# EAGLE design zookCopy2004 (EAGLE 7.2.0)
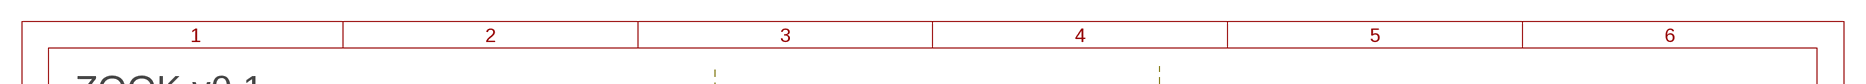
[diagram p0: schematic, sheet 1, part 1 of 2]
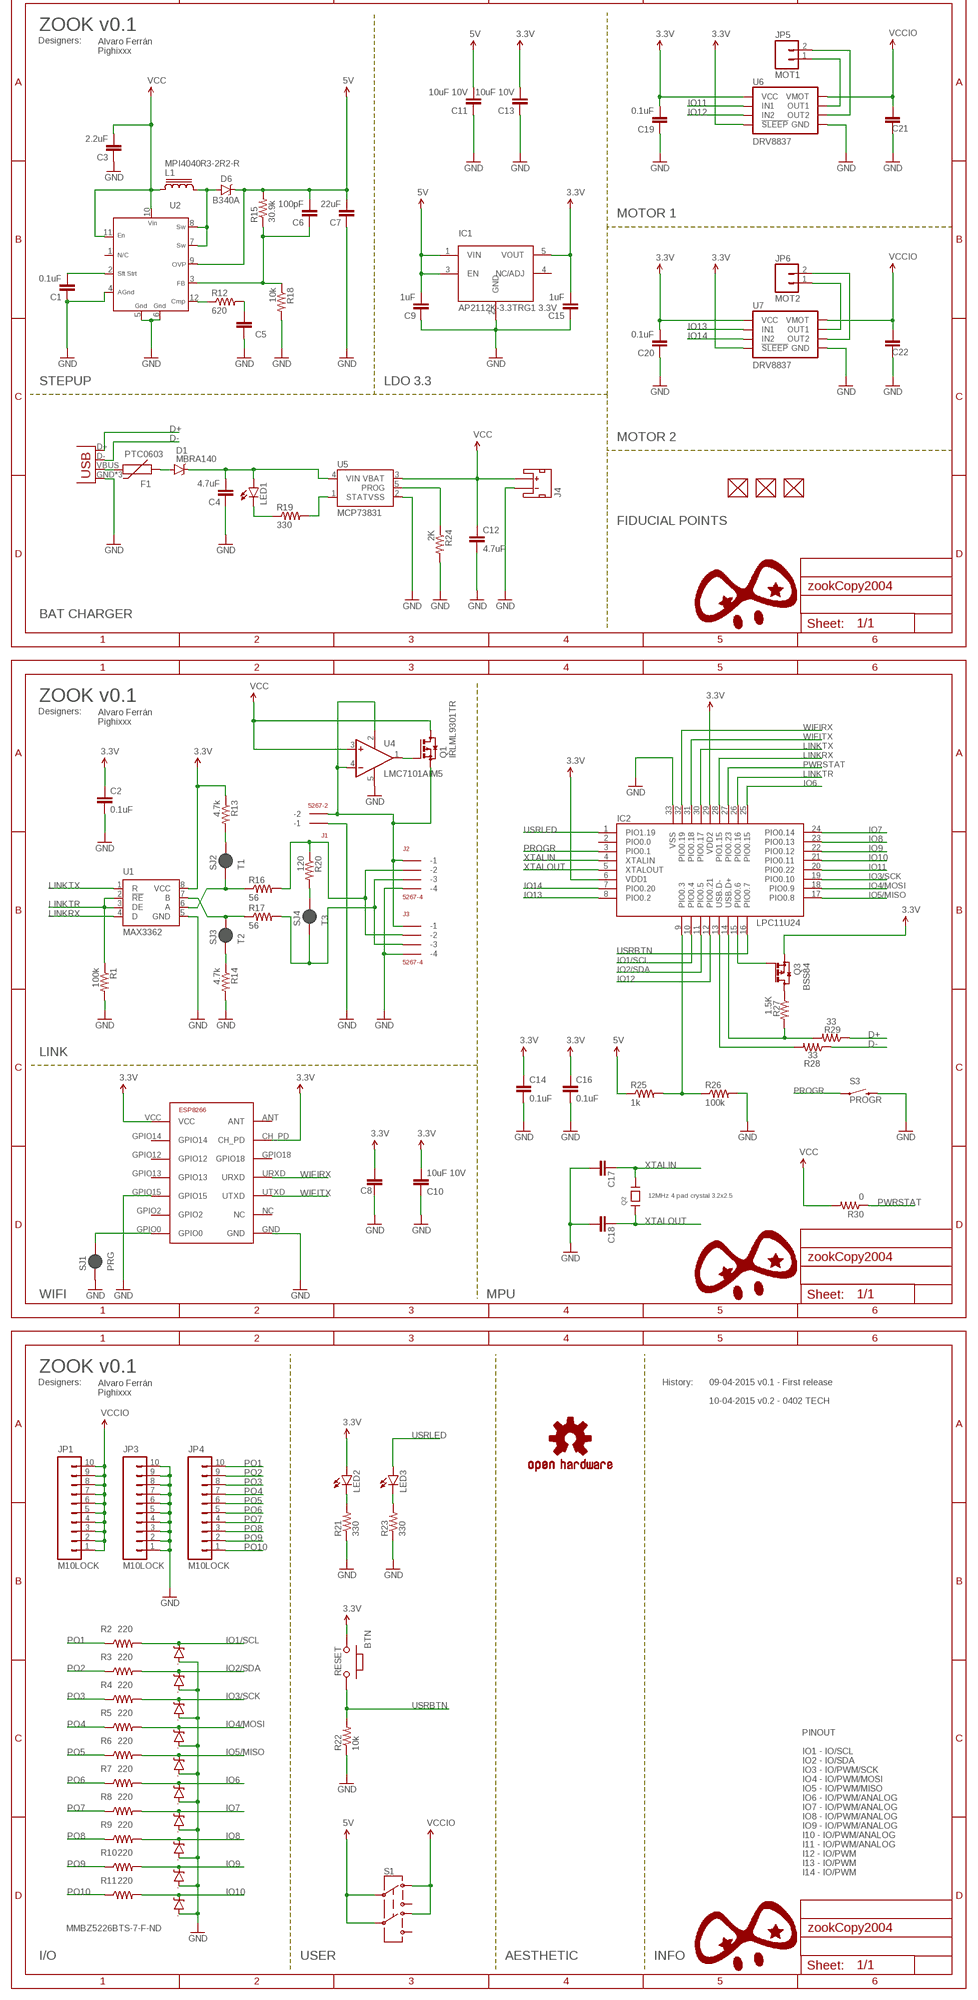
[diagram p1: schematic, sheet 1, part 2 of 2]

## Parts
BTN  RESET  PB157  [157SW]
C1  0.1uF  CAP0402-CAP  [0402-CAP]
C2  0.1uF  CAP0402-CAP  [0402-CAP]
C3  2.2uF  CAP0402-CAP  [0402-CAP]
C4  4.7uF  CAP0402-CAP  [0402-CAP]
C5  10nF  CAP0402-CAP  [0402-CAP]
C6  100pF  CAP0402-CAP  [0402-CAP]
C7  22uF  22UF-6.3V-20%(0805)  [0805]
C8  0.1uF  CAP0402-CAP  [0402-CAP]
C9  1uF  CAP0402-CAP  [0402-CAP]
C10  10uF 10V  CAP0402-CAP  [0402-CAP]
C11  10uF 10V  CAP0402-CAP  [0402-CAP]
C12  4.7uF  CAP0402-CAP  [0402-CAP]
C13  10uF 10V  CAP0402-CAP  [0402-CAP]
C14  0.1uF  CAP0402-CAP  [0402-CAP]
C15  1uF  CAP0402-CAP  [0402-CAP]
C16  0.1uF  CAP0402-CAP  [0402-CAP]
C17  27pF  CAP0402-CAP  [0402-CAP]
C18  27pF  CAP0402-CAP  [0402-CAP]
C19  0.1uF  CAP0402-CAP  [0402-CAP]
C20  0.1uF  CAP0402-CAP  [0402-CAP]
C21  0.1uF  CAP0402-CAP  [0402-CAP]
C22  0.1uF  CAP0402-CAP  [0402-CAP]
D1  MBRA140  [SMA-DIODE]
D2  ZENERARRAY  [SOT363]
D3  ZENERARRAY  [SOT363]
D4  ZENERARRAY  [SOT363]
D5  ZENERARRAY  [SOT363]
D6  B340A  DIODE-SCHOTTKY-B340A  [SMA-DIODE]
F1  PTC0603  [0603]
FUD1  FIDUCIAL  [FIDUCIAL_40MIL]
FUD2  FIDUCIAL  [FIDUCIAL_40MIL]
FUD3  FIDUCIAL  [FIDUCIAL_40MIL]
IC1  AP2112K-3.3TRG1 3.3V  5PIN_REG  [SOT23-5]
IC2  LPC11U24  LPC11U2X_HVQFN33(5X5)  [HVQFN33_5X5MM]
J1  5267-2  [5267-2]
J2  5267-4  [5267-4]
J3  5267-4  [5267-4]
J4  BATT  JST_2MM_MALE  [JST-2-SMD]
JP1  M10LOCK  [1X10_LOCK]
JP2  USB-MICROB  [USB-MICROB]
JP3  M10LOCK  [1X10_LOCK]
JP4  M10LOCK  [1X10_LOCK]
JP5  MOT1  M02POLAR  [MOLEX-1X2]
JP6  MOT2  M02POLAR  [MOLEX-1X2]
L1  MPI4040R3-2R2-R  [MPI4040R3-2R2-R]
LED1  LED0603  [LED-0603]
LED2  LED0603  [LED-0603]
LED3  LED0603  [LED-0603]
LOGO3  OSHW-LOGOS  [OSHW-LOGO-S]
Q1  IRLML9301TR  BSS84  [SOT23]
Q2  12MHz 4 pad crystal 3.2x2.5  CRYSTAL3.2X2.5  [CRYSTAL_3.2X2.5]
Q3  BSS84  [SOT23]
R1  100k  RESISTOR0402-RES  [0402-RES]
R2  220  220KOHM1/10W1%(0603)  [0603-RES]
R3  220  220KOHM1/10W1%(0603)  [0603-RES]
R4  220  220KOHM1/10W1%(0603)  [0603-RES]
R5  220  220KOHM1/10W1%(0603)  [0603-RES]
R6  220  220KOHM1/10W1%(0603)  [0603-RES]
R7  220  220KOHM1/10W1%(0603)  [0603-RES]
R8  220  220KOHM1/10W1%(0603)  [0603-RES]
R9  220  220KOHM1/10W1%(0603)  [0603-RES]
R10  220  220KOHM1/10W1%(0603)  [0603-RES]
R11  220  220KOHM1/10W1%(0603)  [0603-RES]
R12  620  RESISTOR0402-RES  [0402-RES]
R13  4.7k  RESISTOR0402-RES  [0402-RES]
R14  4.7k  RESISTOR0402-RES  [0402-RES]
R15  30.9k  RESISTOR0402-RES  [0402-RES]
R16  56  RESISTOR0402-RES  [0402-RES]
R17  56  RESISTOR0402-RES  [0402-RES]
R18  10k  RESISTOR0402-RES  [0402-RES]
R19  330  RESISTOR0402-RES  [0402-RES]
R20  120  RESISTOR0402-RES  [0402-RES]
R21  330  RESISTOR0402-RES  [0402-RES]
R22  10k  RESISTOR0402-RES  [0402-RES]
R23  330  RESISTOR0402-RES  [0402-RES]
R24  2K  RESISTOR0402-RES  [0402-RES]
R25  1k  RESISTOR0402-RES  [0402-RES]
R26  100k  RESISTOR0402-RES  [0402-RES]
R27  1.5K  RESISTOR0402-RES  [0402-RES]
R28  33  RESISTOR0402-RES  [0402-RES]
R29  33  RESISTOR0402-RES  [0402-RES]
R30  0  RESISTOR0402-RES  [0402-RES]
S1  SWITCH-DPDTOS  [OS]
S3  PROGR  SWITCH-MOMENTARY-2SIDE_EZ  [TACTILE-PTH-SIDEEZ]
SJ1  PRG  JUMPER-PAD-2-NC_BY_PASTE  [PAD-JUMPER-2-NC_BY_PASTE_YES_SILK]
SJ2  T1  JUMPER-PAD-2-NC_BY_PASTE  [PAD-JUMPER-2-NC_BY_PASTE_YES_SILK]
SJ3  T2  JUMPER-PAD-2-NC_BY_PASTE  [PAD-JUMPER-2-NC_BY_PASTE_YES_SILK]
SJ4  T3  JUMPER-PAD-2-NC_BY_PASTE  [PAD-JUMPER-2-NC_BY_PASTE_YES_SILK]
U1  MAX3362  [SOT23-8]
U2  MIC2253  [MLF12_3.0MM_X_3.0MM]
U3  ESP8266  [ESP-03]
U4  LMC7101AIM5  [SOT23-5]
U5  MCP73831  [SOT23-5]
U6  DRV8837  [DSG]
U7  DRV8837  [DSG]

## Nets
3.3V: BTN.1 C2.1 C8.2 C10.2 C13.2 C14.1 C15.2 C16.1 C19.2 C20.2 IC1.5(VOUT) IC2.6(VDD1) IC2.29(VDD2) LED2.A Q3.2(S) R13.1 U1.8(VCC) U3.CH_PD U3.VCC U6.7(!SLEEP) U6.8(VCC) U7.7(!SLEEP) U7.8(VCC)
5V: C6.2 C7.2 C9.2 C11.2 D6.C IC1.1(VIN) IC1.3(EN) R15.2 R25.1 S1.2 S1.5 U2.9(OVP)
D+: JP2.D+ R29.1
D-: JP2.D- R28.1
GND: C1.1 C2.2 C3.1 C4.1 C5.1 C7.1 C8.1 C9.1 C10.1 C11.1 C12.2 C13.1 C14.2 C15.1 C16.2 C17.2 C18.2 C19.1 C20.1 C21.1 C22.1 D2.1(A) D2.2(A) D2.3(A) D3.1(A) D3.2(A) D3.3(A) D4.1(A) D4.2(A) D4.3(A) D5.1(A) IC1.2(GND) IC2.33(VSS) J1.P$1(-1) J2.P$4(-4) J3.P$4(-4) J4.1(-) JP2.GND JP2.MT1(GND) JP2.MT2(GND) JP3.1 JP3.2 JP3.3 JP3.4 JP3.5 JP3.6 JP3.7 JP3.8 JP3.9 JP3.10 R1.2 R14.2 R18.2 R21.1 R22.1 R23.1 R24.2 R26.2 S3.2 SJ1.1 U1.5(GND) U2.4(AGND) U2.5(GND) U2.6(GND) U3.GND U3.GPIO15 U4.5(V-) U5.2(VSS) U6.4(GND) U6.PAD(GND) U7.4(GND) U7.PAD(GND)
IO1/SCL: D2.6(C) IC2.10(PIO0.4) R2.2
IO2/SDA: D2.5(C) IC2.11(PIO0.5) R3.2
IO3/SCK: D2.4(C) IC2.19(PIO0.10) R4.2
IO4/MOSI: D3.6(C) IC2.18(PIO0.9) R5.2
IO5/MISO: D3.5(C) IC2.17(PIO0.8) R6.2
IO6: D3.4(C) IC2.25(PIO0.15) R7.2
IO7: D4.6(C) IC2.24(PIO0.14) R8.2
IO8: D4.5(C) IC2.23(PIO0.13) R9.2
IO9: D4.4(C) IC2.22(PIO0.12) R10.2
IO10: D5.6(C) IC2.21(PIO0.11) R11.2
IO11: IC2.20(PIO0.22) U6.6(IN1)
IO12: IC2.12(PIO0.21) U6.5(IN2)
IO13: IC2.8(PIO0.2) U7.6(IN1)
IO14: IC2.7(PIO0.20) U7.5(IN2)
LINKRX: IC2.28(PIO1.15) U1.4(D)
LINKTR: IC2.26(PIO0.16) R1.1 U1.2(!RE) U1.3(DE)
LINKTX: IC2.30(PIO0.17) U1.1(R)
N$1: J2.P$3(-3) J3.P$3(-3) R17.2 SJ4.1
N$2: LED2.C R21.2
N$3: C5.2 R12.2
N$4: D6.A L1.P$2 U2.7(SW) U2.8(SW)
N$5: C4.2 D1.C LED1.A U5.4(VIN)
N$6: C1.2 U2.2(SS)
N$7: F1.2 JP2.VBUS
N$8: R12.1 U2.12(CMP)
N$9: D1.A F1.1
N$10: JP5.1 U6.2(OUT1)
N$11: JP5.2 U6.3(OUT2)
N$12: R19.2 U5.1(STAT)
N$13: LED1.C R19.1
N$14: JP6.1 U7.2(OUT1)
N$15: JP6.2 U7.3(OUT2)
N$16: R17.1 SJ3.2 U1.7(B)
N$17: R16.1 SJ2.1 U1.6(A)
N$18: R13.2 SJ2.2
N$19: R20.2 SJ4.2
N$20: R14.1 SJ3.1
N$21: J2.P$2(-2) J3.P$2(-2) R16.2 R20.1
N$22: LED3.C R23.2
N$24: C6.1 R15.1 R18.1 U2.3(FB)
N$25: Q1.1(G) U4.1(OUT)
N$26: J1.P$2(-2) J2.P$1(-1) J3.P$1(-1) Q1.2(S) U4.2(V+) U4.4(-IN)
N$27: IC2.14(USB.D+) R27.2 R29.2
N$28: SJ1.2 U3.GPIO0
N$29: IC2.13(USB.D-) R28.2
N$30: Q3.3(D) R27.1
N$31: IC2.15(PIO0.6) Q3.1(G)
P0.3/ISP_COMMAND_USB_HIGH: IC2.9(PIO0.3) R25.2 R26.1
PO1: JP4.10 R2.1
PO2: JP4.9 R3.1
PO3: JP4.8 R4.1
PO4: JP4.7 R5.1
PO5: JP4.6 R6.1
PO6: JP4.5 R7.1
PO7: JP4.4 R8.1
PO8: JP4.3 R9.1
PO9: JP4.2 R10.1
PO10: JP4.1 R11.1
PROG: R24.1 U5.5(PROG)
PROGR: IC2.3(PIO0.1) S3.1
PWRSTAT: IC2.27(PIO0.23) R30.1
USRBTN: BTN.2 IC2.16(PIO0.7) R22.2
USRLED: IC2.1(PIO1.19) LED3.A
VCC: C3.2 C12.1 J4.2(+) L1.P$1 Q1.3(D) R30.2 U2.10(VIN) U2.11(EN) U4.3(+IN) U5.3(VBAT)
VCCIO: C21.2 C22.2 JP1.1 JP1.2 JP1.3 JP1.4 JP1.5 JP1.6 JP1.7 JP1.8 JP1.9 JP1.10 S1.1 S1.4 U6.1(VMOT) U7.1(VMOT)
WIFIRX: IC2.32(PIO0.19) U3.URXD
WIFITX: IC2.31(PIO0.18) U3.UTXD
XTALIN: C17.1 IC2.4(XTALIN) Q2.3
XTALOUT: C18.1 IC2.5(XTALOUT) Q2.1
Unconnected: D5.2(A) D5.3(A) D5.4(C) D5.5(C) FUD1.P$1 FUD2.P$1 FUD3.P$1 IC1.4(NC/ADJ) IC2.2(PIO0.0) J4.NC1(PAD1) J4.NC2(PAD2) S1.3 S1.6 U2.1(NC) U3.ANT U3.GPIO2 U3.GPIO12 U3.GPIO13 U3.GPIO14 U3.GPIO18 U3.NC

## Notes on the sheet
- ZOOK v0.1
- Designers: | Alvaro Ferrán
- Pighixxx
- MOTOR 1
- STEPUP | LDO 3.3
- MOTOR 2
- FIDUCIAL POINTS
- BAT CHARGER
- ZOOK v0.1
- Designers: | Alvaro Ferrán
- Pighixxx
- LINK
- WIFI | MPU
- ZOOK v0.1
- Designers: | Alvaro Ferrán | History: | 09-04-2015 v0.1 - First release
- Pighixxx
- 10-04-2015 v0.2 - 0402 TECH
- PINOUT
- IO1 - IO/SCL
- IO2 - IO/SDA
- IO3 - IO/PWM/SCK
- IO4 - IO/PWM/MOSI
- IO5 - IO/PWM/MISO
- IO6 - IO/PWM/ANALOG
- IO7 - IO/PWM/ANALOG
- IO8 - IO/PWM/ANALOG
- IO9 - IO/PWM/ANALOG
- I10 - IO/PWM/ANALOG
- I11 - IO/PWM/ANALOG
- I12 - IO/PWM
- I13 - IO/PWM
- I14 - IO/PWM
- MMBZ5226BTS-7-F-ND
- I/O | USER | AESTHETIC | INFO

## Library data of the parts
BTN = MySMD:PB157
C1-C6 C8-C22 = SparkFun-Passives:CAP: Capacitor Standard 0603 ceramic capacitor, and 0.1" leaded capacitor.
C7 = SparkFun-Capacitors:22UF-6.3V-20%(0805): CAP-08402 Ceramic; PROD_ID: CAP-08402
D1 = SparkFun-DiscreteSemi:MBRA140: 40V, 1A Schottky rectifier SMA/DO-214AC package DIO-08053; PROD_ID: DIO-08053
D2-D5 = Diode-Array:ZENERARRAY
D6 = SparkFun-DiscreteSemi:DIODE-SCHOTTKY: Schottky diodes in SFE's production catalog BAT20J 1A 23V 0.62Vf RB751 120mA 40V 0.37Vf PMEG4005EJ 0.5A 40V 0.42Vf MBRA140 1A 40V 0.5Vf B340A 3A 40V SMA; PROD_ID: DIO-09886
F1 = SparkFun-PowerIC:PTC: Resettable Fuse PTC Resettable Fuse. Spark Fun Electronics SKU : COM-08357
FUD1-FUD3 = GHI:FIDUCIAL
IC1 = GHI:5PIN_REG
IC2 = GHI-SoMs-Processors:LPC11U2X_HVQFN33(5X5)
J1 = con-molex-spox:5267-2
J2 J3 = con-molex-spox:5267-4
J4 = SparkFun-Connectors:JST_2MM_MALE: Mates to single-cell LiPo batteries. CONN-08352; PROD_ID: CONN-08352
JP1 JP3 JP4 = SparkFun-Connectors:M10: Header 10 Standard 10-pin 0.1" header. Use with straight break away headers (SKU : PRT-00116), right angle break away headers (PRT-00553), swiss pins (PRT-00743), machine pins (PRT-00117), and female headers (PRT-00115).
JP2 = SparkFun-Connectors:USB: USB Connectors USB-B-PTH is fully proven SKU : PRT-00139/CONN-08278 USB-miniB is fully proven SKU : PRT-00587 USB-A-PCB is untested. USB-A-H is throughly reviewed, but untested. Spark Fun Electronics SKU : PRT-00437 USB-B-SMT is throughly reviewed, but untested. Needs silkscreen touching up. USB-A-S has not been used/tested USB-MB-H has not been used/tested USB-MICROB has been used. CONN-09505; PROD_ID: CONN-09505
JP5 JP6 = SparkFun-Connectors:M02: Standard 2-pin 0.1" header. Use with - straight break away headers ( PRT-00116) - right angle break away headers (PRT-00553) - swiss pins (PRT-00743) - machine pins (PRT-00117) - female headers (PRT-00115) Molex polarized connector foot print use with: PRT-08233 with associated crimp pins and housings. 2.54_SCREWTERM for use with PRT-10571. 3.5mm Screw Terminal footprints for PRT-08084 5mm Screw Terminal footprints for use with PRT-08432
L1 = inductor-Eaton Bussmann:MPI4040R3-2R2-R
LED1-LED3 = SparkFun-LED:LED: LEDs Standard schematic elements and footprints for 5mm, 3mm, 1206, and 0603 sized LEDs. 5mm - Spark Fun Electronics SKU : COM-00529 (and others)
LOGO3 = SparkFun-Aesthetics:OSHW-LOGO: Open Source Hardware Logo This logo indicates the piece of hardware it is found on incorporates a OSHW license and/or adheres to the definition of open source hardware found here: http://freedomdefined.org/OSHW
Q1 Q3 = transistor-small-signal:BSS84: P-CHANNEL MOS FET
Q2 = GHI:CRYSTAL3.2X2.5
R1 R12-R30 = SparkFun-Passives:RESISTOR: Resistor Basic schematic elements and footprints for 0603, 1206, and PTH resistors.
R2-R11 = SparkFun-Resistors:220KOHM1/10W1%(0603): RES-08969; PROD_ID: RES-08969; VALUE: 220k
S1 = SparkFun-Electromechanical:SWITCH-DPDT: DPDT Version of the COM-00597
S3 = SparkFun-Electromechanical:SWITCH-MOMENTARY-2: Various NO switches- pushbuttons, reed, etc
SJ1-SJ4 = SparkFun-Passives:JUMPER-PAD-2-NC_BY_PASTE
U1 = MAX3362:MAX3362: MAX3362 3.3V, High-Speed, RS-485/RS-422 Transceiver in SOT23-8 Package
U2 = MIC2253_MLF12:MIC2253: MIC2253 - 3.5A, 1 MHz High Efficiency, Variable Voltage Inuput Boost Regulator with Over Voltage Protection and Soft-Start, Micrel 02-13-2013 - troneeee@gmail.com
U3 = ESP8266:ESP8266: low cost Wifi to Serial Module
U4 = linear:LMC7101AIM5
U5 = SparkFun-PowerIC:MCP73831: Miniature single cell, fully integrated Li-Ion, Li-polymer charge management controller http://ww1.microchip.com/downloads/en/DeviceDoc/21984a.pdf IC-09995; PROD_ID: IC-09995
U6 U7 = packages(ti):DRV8837

## Net classes
0 default: width 0.254 mm, drill 0.254 mm, clearance 0.203 mm

## Board
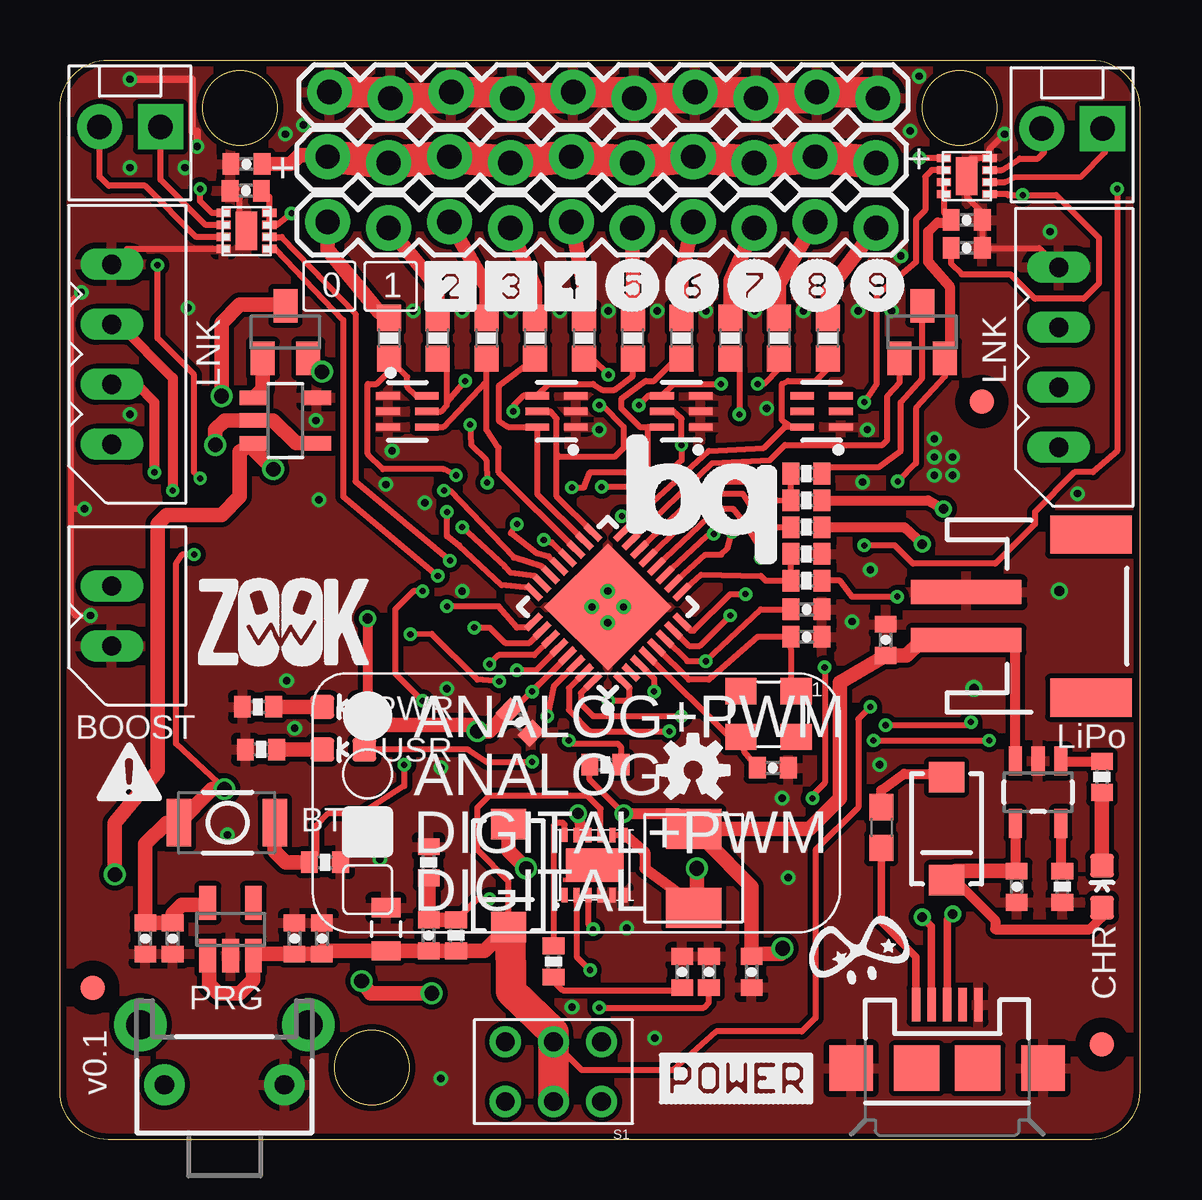
[diagram p2: board, top side]
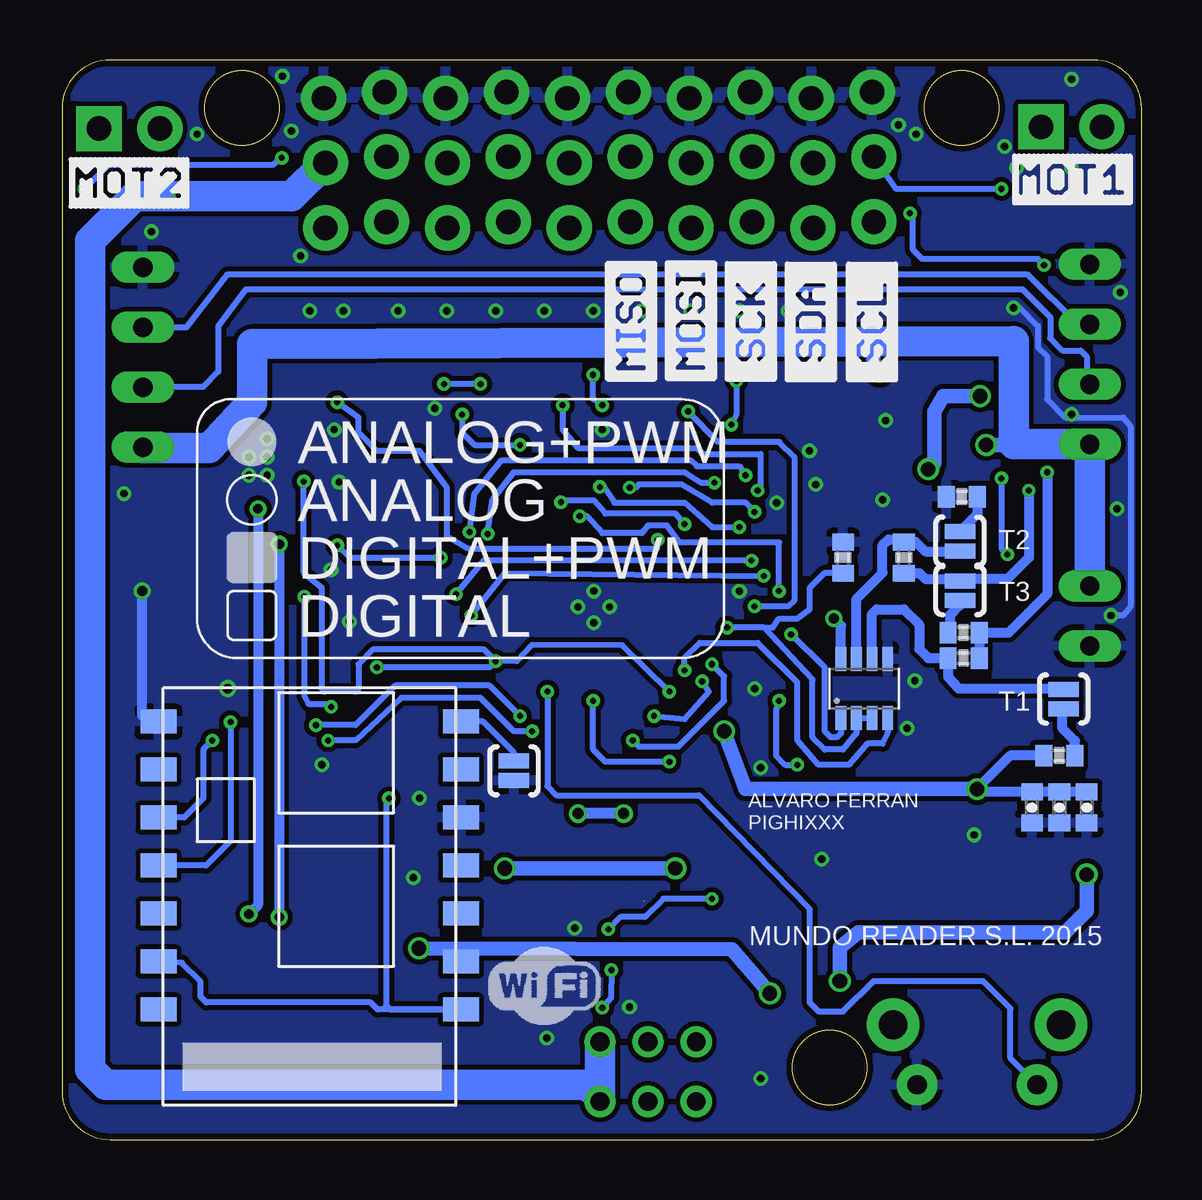
[diagram p3: board, bottom side, seen from below]

Size 45 x 45 mm. Coordinates in mm from the lower left corner, seen from the top.
Outline: 0,2 0,43 arc-90 2,45 43,45 arc-90 45,43 45,2 arc-90 43,0 2,0 arc-90 0,2
Outline: circle at 7.5,43 radius 1.55
Outline: circle at 37.5,43 radius 1.55
Outline: circle at 13,3 radius 1.55
Copper layers (1*16): Top 0.035mm / dielectric 1.5mm / Bottom 0.035mm
Design rules "pighixxx_CAM_DRC_V1.0": minimum track width 6mil, minimum drill 12mil, track to track 6mil, track to pad 6mil, pad to pad 6mil, via to via 6mil, smd to smd 0mil, copper to edge 10mil, drill to drill 10mil, minimum pad ring 10mil, minimum via ring 6mil, stop-mask expansion 2mil, vias tented up to drill 100mil, thermal gap 10mil

### Footprints (pad centres in the part's own frame; a part is rotated, then mirrored left to right if it is on the bottom)
157SW = smd 1.016 x 1.981: 1 0,0; 2 4,0
0402-CAP = smd 0.7 x 0.9: 1 -0.65,0; 2 0.65,0
0805 = smd 0.8 x 1.2: 1 -0.9,0; 2 0.9,0
SMA-DIODE = smd 1.27 x 1.47: A -2.15,0; C 2.15,0
SOT363 = smd 0.3 x 0.99: 1 0.62,0.47; 2 1.27,0.47; 3 1.92,0.47; 4 1.92,2.08; 5 1.27,2.08; 6 0.62,2.08
0603 = smd 1.1 x 1: 1 -0.85,0; 2 0.85,0
FIDUCIAL_40MIL = smd 1.016 x 1.016: P$1 0,0
SOT23-5 = smd 0.7 x 1.4: 1 0.95,1.1; 2 0,1.1; 3 -0.95,1.1; 4 -0.95,-1.1; 5 0.95,-1.1
HVQFN33_5X5MM = smd 0.85 x 0.27: 1 -2.625,1.75; 2 -2.625,1.25; 3 -2.625,0.75; 4 -2.625,0.25; 5 -2.625,-0.25; 6 -2.625,-0.75; 7 -2.625,-1.25; 8 -2.625,-1.75; 17 2.625,-1.75; 18 2.625,-1.25; 19 2.625,-0.75; 20 2.625,-0.25; 21 2.625,0.25; 22 2.625,0.75; 23 2.625,1.25; 24 2.625,1.75 | smd 0.27 x 0.85: 9 -1.75,-2.625; 10 -1.25,-2.625; 11 -0.75,-2.625; 12 -0.25,-2.625; 13 0.25,-2.625; 14 0.75,-2.625; 15 1.25,-2.625; 16 1.75,-2.625; 25 1.75,2.625; 26 1.25,2.625; 27 0.75,2.625; 28 0.25,2.625; 29 -0.25,2.625; 30 -0.75,2.625; 31 -1.25,2.625; 32 -1.75,2.625 | smd 3.75 x 3.75: 33 0,0
5267-2 = drill 0.8 long: P$1 0,0; P$2 2.5,0
5267-4 = drill 0.8 long: P$1 0,0; P$2 2.5,0; P$3 5,0; P$4 7.5,0
JST-2-SMD = smd 1 x 4.6: 1 -1,-3.7; 2 1,-3.7 | smd 1.6 x 3.4: NC1 -3.4,1.5; NC2 3.4,1.5
1X10_LOCK = drill 1.016 pad 1.88: 1 0,0.127; 2 2.54,-0.127; 3 5.08,0.127; 4 7.62,-0.127; 5 10.16,0.127; 6 12.7,-0.127; 7 15.24,0.127; 8 17.78,-0.127; 9 20.32,0.127; 10 22.86,-0.127
USB-MICROB = smd 0.35 x 1.4: D+ 0,2.65; D- -0.65,2.65; GND 1.3,2.65; ID 0.65,2.65; VBUS -1.3,2.65 | smd 1.8 x 1.9: MT1 -4,0; MT2 4,0 | smd 1.9 x 1.9: P$1 -1.27,0; P$2 1.27,0
MOLEX-1X2 = drill 1.016 pad 1.88 square: 1 0,0 | drill 1.016 pad 1.88: 2 2.54,0
MPI4040R3-2R2-R = smd 1.65 x 2.3: P$1 -1.645,0; P$2 1.645,0
LED-0603 = smd 1 x 1: A 0,-0.877; C 0,0.877
SOT23 = smd 1 x 1.4: 1 -0.95,-1.1; 2 0.95,-1.1; 3 0,1.1
CRYSTAL_3.2X2.5 = smd 1.3 x 1.1: 1 -1.1,-0.9; 2 1.2,-0.9; 3 1.2,1; 4 -1.1,1
0402-RES = smd 0.7 x 0.9: 1 -0.65,0; 2 0.65,0
0603-RES = smd 1.1 x 1: 1 -0.85,0; 2 0.85,0
OS = drill 0.787 pad 1.27: 1 -2.007,1.245; 2 0,1.245; 3 2.007,1.245; 4 -2.007,-1.245; 5 0,-1.245; 6 2.007,-1.245
TACTILE-PTH-SIDEEZ = drill 0.8 pad 1.7: 1 -2.5,0; 2 2.5,0 | drill 1.2 pad 2.2: ANCHOR1 -3.5,2.5; ANCHOR2 3.5,2.5
PAD-JUMPER-2-NC_BY_PASTE_YES_SILK = smd 0.635 x 1.27: 1 -0.401,0; 2 0.413,0
SOT23-8 = smd 1 x 0.45: 1 -1.225,0.975; 2 -1.225,0.325; 3 -1.225,-0.325; 4 -1.225,-0.975; 5 1.225,-0.975; 6 1.225,-0.325; 7 1.225,0.325; 8 1.225,0.975
MLF12_3.0MM_X_3.0MM = smd 0.6 x 0.25: 1 -1.244,1.291; 2 -1.242,0.79; 3 -1.242,0.29; 4 -1.242,-0.21; 5 -1.242,-0.71; 6 -1.242,-1.21; 7 1.265,-1.211; 8 1.265,-0.711; 9 1.265,-0.211; 10 1.265,0.289; 11 1.265,0.789; 12 1.266,1.29 | smd 1.4 x 2.4: EXP 0.01,0.038
ESP-03 = smd 1 x 1.5: ANT 4,12.4; CH_PD 6,12.4; GND 16,12.4; GPIO0 16,-0.2; GPIO2 14,-0.2; GPIO12 8,-0.2; GPIO13 10,-0.2; GPIO14 6,-0.2; GPIO15 12,-0.2; GPIO18 8,12.4; NC 14,12.4; URXD 10,12.4; UTXD 12,12.4; VCC 4,-0.2
SOT23-5' = smd 0.6 x 1.2: 1 -0.95,-1.306; 2 0,-1.306; 3 0.95,-1.306; 4 0.95,1.306; 5 -0.95,1.306
SOT23-5'' = smd 0.55 x 1.2: 1 -0.95,-1.3; 2 0,-1.3; 3 0.95,-1.3; 4 0.95,1.3; 5 -0.95,1.3
DSG = smd 0.6 x 0.35: 1 -0.95,0.75; 2 -0.95,0.25; 3 -0.95,-0.25; 4 -0.95,-0.75; 5 0.95,-0.75; 6 0.95,-0.25; 7 0.95,0.25; 8 0.95,0.75 | smd 0.9 x 1.6: PAD 0,0

### Placement (x,y rotation side)
BTN  4.95,13.21 0 top
C1  27.05,6.99 270 top
C2  4.57,13.84 270 bottom
C3  28.83,6.99 90 top
C4  39.88,10.54 90 top
C5  25.93,6.99 270 top
C6  15.37,8.51 270 top
C7  13.59,8.76 270 top
C8  2.29,13.84 90 bottom
C9  9.78,8.38 270 top
C10  3.43,13.84 90 bottom
C11  10.92,8.38 270 top
C12  34.42,20.83 90 top
C13  3.56,8.38 90 top
C14  31.11,22.1 0 top
C15  4.7,8.38 90 top
C16  19.18,17.4 315 top
C17  29.72,15.49 0 top
C18  31.11,20.96 0 top
C19  37.8,38.33 180 top
C20  7.75,39.55 0 top
C21  37.8,37.17 180 top
C22  7.77,40.67 0 top
D1  36.96,12.95 270 top
D2  13.21,31.62 270 top
D3  21.97,29.08 90 top
D4  27.18,29.08 90 top
D5  33.02,29.08 90 top
D6  18.69,11 270 top
F1  34.24,13 270 top
FUD1  1.36,6.33 0 top
FUD2  43.43,3.96 0 top
FUD3  38.43,30.76 0 top
IC1  7.11,8.76 180 top
IC2  22.83,22.2 135 top
J1  2.16,20.57 90 top
J2  2.16,28.98 90 top
J3  41.63,28.85 90 top
J4  41.48,21.82 270 top
JP1  34.02,40.84 180 top
JP2  36.98,2.97 0 top
JP3  34.09,43.54 180 top
JP4  34.02,38.13 180 top
JP5  43.46,42.14 180 top
JP6  4.19,42.21 180 top
L1  26.42,11.3 270 top
LED1  43.43,10.54 0 top
LED2  11.81,18.03 90 top
LED3  11.81,16.26 90 top
LOGO3  26.39,15.39 0 top
Q1  9.4,33.66 0 top
Q2  29.59,17.78 180 top
Q3  35.94,33.66 0 top
R1  12.45,24.26 90 bottom
R2  13.72,33.4 270 top
R3  15.75,33.4 270 top
R4  17.78,33.4 270 top
R5  19.81,33.4 270 top
R6  21.84,33.4 270 top
R7  23.88,33.4 270 top
R8  25.91,33.4 270 top
R9  27.94,33.4 270 top
R10  29.97,33.4 270 top
R11  32,33.4 270 top
R12  20.57,7.42 270 top
R13  3.43,16 0 bottom
R14  7.49,26.8 180 bottom
R15  16.51,8.51 270 top
R16  7.42,20.07 0 bottom
R17  9.91,24.26 270 bottom
R18  15.37,11.56 90 top
R19  43.43,15.11 90 top
R20  7.42,21.13 180 bottom
R21  8.25,18.03 0 top
R22  11.05,11.56 180 top
R23  8.38,16.26 0 top
R24  41.78,10.54 270 top
R25  31.11,23.29 180 top
R26  31.11,24.41 0 top
R27  31.11,27.76 180 top
R28  31.11,25.53 180 top
R29  31.11,26.64 180 top
R30  22.73,15.62 180 top
S1  20.57,2.83 180 top
S3  6.86,2.29 0 top
SJ1  26.16,15.37 90 bottom
SJ2  3.25,18.36 270 bottom
SJ3  7.57,24.94 270 bottom
SJ4  7.57,22.89 270 bottom
U1  11.56,18.8 90 bottom
U2  22.33,11.43 90 top
U3  28.57,1.42 90 bottom
U4  LMC7101AIM5  [SOT23-5']  9.4,29.97 270 top
U5  MCP73831  [SOT23-5'']  40.77,14.48 180 top
U6  37.8,40.16 180 top
U7  7.77,37.87 0 top
U$1  [S_1_P]  12.65,34.49 0 top
U$2  [S_2]  15.3,34.62 0 top
U$3  [S_0_P]  10.1,34.5 0 top
U$4  [S_5_R]  22.97,34.59 0 top
U$5  [S_3]  17.82,34.64 0 top
U$6  [S_4]  20.3,34.63 0 top
U$7  [S_6_R]  25.46,34.57 0 top
U$8  [S_7_R]  28.05,34.58 0 top
U$9  [S_8_R]  30.67,34.58 0 top
U$10  [S_9_R]  33.18,34.58 0 top
U$11  [S_SCL]  12.21,31.67 0 bottom
U$12  [S_SDA]  14.76,31.67 0 bottom
U$13  [S_MOSI]  19.77,31.72 0 bottom
U$14  [S_MISO]  22.26,31.7 0 bottom
U$15  [S_SCK]  17.27,31.69 0 bottom
U$16  [S_MOT1]  5.3,40.99 270 bottom
U$17  [S_MOT2]  44.62,40.85 270 bottom
U$18  [S_LEGEND]  39.24,19.94 0 bottom
U$19  [S_POWER]  25.06,3.53 270 top
U$20  [S_WIFI]  27.2,4.79 0 bottom
U$21  [S_ZOOK_LOGO]  5.71,19.68 0 top
U$22  [BQ_LOGO]  23.62,24 0 top
U$23  [PIGHIXXX_LOGO]  31.24,6.48 0 top
U$24  [S_LEGEND]  10.67,8.51 0 top

### Tracks (layer width: path | path; a pad name or v marks a point on that pad's centre or on a via)
3.3V  (via drill 0.25, 0.41, 0.6)
  Top 0.254: C20.2 8.72,39.3 U7.8 U7.7 9.04,38.12 v9.65,38.61 | v6.86,14.61 4.83,16.51 4.83,24 5.08,24.38 v5.59,24.38 | IC2.6 26.16,19.94 v26.92,19.94 29.21,22.1 C14.1 | C16.1 18.85,17.86 IC2.29 21.15,20.14 v19.68,18.67 | Q3.2 36.89,31.81 35.69,30.48 35.69,28.19 v34.92,27.43 | v31.88,19.68 31.88,14.86 31.37,14.35 v31.37,14.22 | v5.84,27.56 5.59,27.81 5.59,31.88 4.06,33.4 v4.06,36.45 | U6.7 U6.8 36.84,38.63 C19.2
  Top 0.406: Q3.2 37.08,32.75 37.08,35.56 36.19,36.58 36.19,37.85 36.58,38.23 37.04,38.23 C19.2 | v12.83,21.72 12.83,18.3 LED2.A
  Top 0.61: IC1.5 6.08,9.78 5.08,9.78 4.7,9.4 C15.2 C13.2 3.56,12.32 4.45,13.21 BTN.1 6.35,14.61 v6.86,14.61 | C16.1 17.88,17.02 v17.4,17.02 17.14,17.27 13.58,17.27 LED2.A
  Bottom 0.254: v19.68,18.67 21.64,20.6 25.4,20.62 26.04,19.94 v26.92,19.94 | v31.88,19.68 27.18,19.68 v26.92,19.94 | U3.CH_PD 40,7.37 39.23,6.59 39.23,5.96 38.99,5.71 32.13,5.71 31.84,5.42 U3.VCC 31.33,5.42 31.5,5.59 31.5,14.1 v31.37,14.22 | v26.92,19.94 27.43,20.45 32,20.45 32.64,19.81 32.64,18.8 32.77,18.67 34.04,18.67 34.16,18.8 34.16,22.99 34.92,23.62 v34.92,27.43 | v5.84,27.56 5.84,24.64 v5.59,24.38 | v4.06,36.45 4.32,36.7 9.14,36.7 9.52,37.08 9.52,38.48 v9.65,38.61
  Bottom 0.406: R13.1 5.46,16 v6.86,14.61 6.75,14.49 C2.1 C10.2 C8.2 | U1.8 12.53,21.42 v12.83,21.72
  Bottom 0.61: v6.86,14.61 16.51,14.61 v17.4,17.02
5V  (via drill 0.25)
  Top 0.254: D6.C 18.69,10.77 17.4,12.07 17.4,13.84 17.91,14.35 21.97,14.35 22.54,13.78 U2.9 | v33.78,18.03 33.27,17.53 33.27,13.84 31.5,12.07 31.5,5.07 30.93,4.5 27.35,4.5 25.53,2.88 21.76,2.88 S1.5 | v34.9,22.63 33.02,22.63 32.51,23.29 R25.1
  Top 0.61: D6.C 17.7,7.86 R15.2 C6.2 C7.2 10.92,7.86 C11.2 C9.2 8.13,7.73 IC1.3 8.06,6.67 7.49,6.1 6.6,6.1 6.22,6.48 6.22,7.6 IC1.1
  Top 1.27: S1.2 S1.5 20.57,4.46 18.8,6.19 18.79,8.77 D6.C
  Bottom 0.254: v34.9,22.63 34.9,18.49 34.72,18.16 33.91,18.16 v33.78,18.03
D+  (via drill 0.41)
  Top 0.305: JP2.D+ 36.98,9.17 v37.21,9.4
  Top 0.406: R29.1 36.19,26.64 v36.83,26.29
  Bottom 0.406: v36.83,26.29 36.83,9.78 v37.21,9.4
D-  (via drill 0.41)
  Top 0.305: v35.94,9.27 36.33,8.88 JP2.D-
  Top 0.406: R28.1 35.18,25.53 v35.94,24.82
  Bottom 0.406: v35.94,24.82 v35.94,9.27
GND  (via drill 0.3, 0.41)
  Top 0.254: 7.37,39.62 C20.1 7.49,39.23 7.49,37.9 7.75,37.9 U7.PAD | U7.4 2.8,37.12 J2.P$4 | 26.72,29.72 D4.1 | U6.PAD 37.82,39.28 37.82,39.27 38.44,38.64 C19.1 C21.1 40.82,37.17 J3.P$4 | 37.72,40.61 U6.PAD | v1.27,21.84 0.63,21.84 0.46,22.1 0.46,26.29 | v0.89,35.31 0.52,34.99 0.46,34.92 0.46,26.29 | v39.37,41.91 38.75,41.28 U6.4 37.99,40.91 37.85,40.77 37.85,40.21 U6.PAD | v1.02,26.29 0.46,26.29
  Top 0.305: v2.92,44.2 5.51,44.2 5.51,42.04 5.71,42.04 v5.71,41.4
  Top 0.406: v22.17,22.2 22.15,22.23 22.1,22.23 22.12,22.2
  Top 0.61: 22.12,22.2 IC2.33
  Top 1.27: JP3.10 13.52,43.66 JP3.9 16.06,43.41 JP3.8 18.6,43.66 JP3.7 21.14,43.41 JP3.6 23.68,43.66 JP3.5 26.22,43.41 JP3.4 28.76,43.66 JP3.3 31.3,43.41 JP3.2 33.84,43.66 JP3.1
  Bottom 0.254: 5.46,34.67 5.08,34.67 4.32,33.91 4.32,33.02 3.94,32.64 3.94,30.86 3.18,30.1 0.76,30.1 0.46,29.72 0.46,22.23 0.76,21.84 v1.27,21.84
  Bottom 0.406: U3.GND 41.38,17.42 41.4,17.4 41.66,17.65 v41.66,22.86
  other vias: 22.83,22.86 23.5,22.2 22.83,21.54 23.62,8.81 22.48,29.59 29.46,30.48 13.34,11.68 6.98,12.7 13.84,28.7 33.66,29.59 33.78,23.75 30.1,14.22 33.02,21.59 9.45,19.13 10.67,29.97 10.79,26.67 10.14,42.29 9.4,41.91 5.21,40.51 36.45,29.21 36.45,28.45 36.45,27.69 37.21,28.45 37.21,27.69 15.88,2.54 38.1,18.8 5.33,34.67 30.35,10.92 2.92,30.23 15.21,26.54 13.59,27.31 34.16,15.62 22.86,34.54 24.89,34.54 26.92,34.54 28.96,34.54 30.99,34.54 20.83,34.54 18.8,34.54 16.76,34.54 14.73,34.54 33.27,34.54 42.42,26.92 2.92,40.51 34.67,34.54 33.45,27.41 15.88,15.49 16.13,18.8 16.76,22.86 9.78,17.14 24.79,4.23 21.35,5.52 35.81,44.32 35.43,42.04 35.43,42.04 41.28,37.85 35.05,36.83
  pour Top: -0.38,45.72 48.13,45.85 48.13,-1.78 -0.38,-1.9
  pour Bottom: -1.52,46.86 46.99,46.99 46.99,-0.63 -1.52,-0.76
IO1/SCL  (via drill 0.25)
  Top 0.254: 14.87,31 D2.6 14.84,31 14.48,31.37 14.48,31.79 R2.2 13.72,32 13.21,31.5 12.83,31.5 12.83,28.57 13.46,27.94 16,27.94 v16.51,27.69 | IC2.10 26.91,24.38 27.56,24.38 27.81,24.64 v28.02,25.32
  Bottom 0.254: v16.51,27.69 16.76,28.07 18.54,28.07 18.8,28.32 26.67,28.32 27.81,26.92 v28.02,25.32
IO2/SDA  (via drill 0.25)
  Top 0.254: D2.5 15.88,30.35 16.13,30.61 16.13,30.73 | 16.13,30.73 16.13,32.17 R3.2 | 16.13,30.73 v16.89,31.62 | IC2.11 26.97,25.15 v27.25,25.25 | v17.09,29.79 17.14,28.96 17.78,28.32 v17.81,27.38
  Bottom 0.254: v16.89,31.62 16.89,30.23 v17.09,29.79 | v27.25,25.25 27.05,26.67 26.16,27.81 19.05,27.81 18.36,27.38 v17.81,27.38
IO3/SCK
  Top 0.254: IC2.19 18.29,27.81 18.29,28.83 17.78,29.59 17.78,31.62 | 17.78,31.62 R4.2 | D2.4 15.99,29.7 17.78,31.62
IO4/MOSI
  Top 0.254: R5.2 18.29,31.41 18.29,29.97 18.68,29.7 D3.6 19.89,26.91 IC2.18
IO5/MISO  (via drill 0.25)
  Top 0.254: IC2.17 20.7,26.81 20.7,28.57 | R6.2 22.19,32.55 v22.86,31.88 | v22.48,30.61 22.61,30.61 23.5,29.72 23.5,28.83 23.11,28.45 20.83,28.45 20.7,28.57 | 20.7,28.57 20.7,30.05 20.45,30.35 D3.5
  Bottom 0.254: v22.48,30.61 22.86,30.86 v22.86,31.88
IO6  (via drill 0.25)
  Top 0.254: R7.2 23.88,31.83 23.11,31.24 22.61,31.24 22.22,31.5 20.38,31.5 D3.4 19.32,31 18.92,30.61 v18.9,30.35 | IC2.25 19.5,21.34 19.05,21.34 18.29,22.23 v16.13,22.23
  Bottom 0.254: v16.13,22.23 14.73,22.23 14.48,22.48 14.48,28.45 15.11,29.08 17.65,29.08 v18.9,30.35
IO7  (via drill 0.25)
  Top 0.254: 24.51,29.7 24.17,29.7 23.39,30.48 23.39,30.86 24.41,31.62 24.76,31.62 25.69,32.55 R8.2 | 24.51,29.7 D4.6 | IC2.24 19.57,22.99 18.42,23.11 16.64,24.77 16.13,25.15 v16.13,26.16 | v21.34,27.18 21.84,27.18 22.1,27.81 24.51,27.81 24.51,29.7
  Bottom 0.254: v16.13,26.16 16.51,26.54 17.91,26.54 19.18,27.31 20.96,27.31 21.08,27.18 v21.34,27.18
IO8  (via drill 0.25)
  Top 0.254: v22.58,27.2 24.64,27.2 25.91,28.32 v25.91,28.96 25.91,30.05 25.58,30.35 D4.5 | v16.76,25.53 18.54,23.88 18.8,23.62 19.77,23.5 IC2.23 | R9.2 28.32,32.17 v28.32,30.23
  Bottom 0.254: v25.91,28.96 27.81,28.96 28.32,29.46 v28.32,30.23 | v22.58,27.2 22.4,27.2 21.97,26.54 19.05,26.54 17.91,25.53 v16.76,25.53
IO9  (via drill 0.25)
  Top 0.254: R10.2 29.97,32.13 29.34,31.5 v29.08,31.5 | v27.56,31.5 25.59,31.5 D4.4 24.53,31 v24.13,30.61 | IC2.22 20.1,23.88 18.92,24.26 16.26,27.05 v16,27.05
  Bottom 0.254: v27.56,31.5 v29.08,31.5 | v24.13,30.61 24.13,29.59 23.5,28.83 18.54,28.83 18.29,28.57 15.88,28.57 15.88,27.18 v16,27.05
IO10  (via drill 0.25)
  Top 0.254: IC2.21 20.37,24.31 19.89,24.43 18.8,25.27 v19.05,25.65 | v24.21,26.57 24.71,26.57 27.05,28.7 29.34,28.83 30.21,29.7 D5.6 30.5,29.7 30.1,29.97 30.1,31.5 30.35,31.62 31.5,31.62 32,32.13 R11.2
  Bottom 0.254: v19.05,25.65 19.43,26.09 22.35,26.09 22.83,26.64 24.08,26.64 v24.21,26.57
IO11  (via drill 0.25)
  Top 0.254: v33.53,30.73 34.04,31.5 34.04,35.18 35.69,36.58 35.69,38.35 36.07,38.73 36.07,40.13 36.34,40.41 U6.6 | v20.17,24.99 20.5,24.89 IC2.20
  Bottom 0.254: v20.17,24.99 20.19,24.64 28.07,24.64 28.96,25.15 28.96,27.18 30.1,28.7 31.88,28.7 32.64,29.46 32.64,30.1 v33.53,30.73
IO12  (via drill 0.25)
  Top 0.254: v33.53,24.77 34.8,24.77 35.56,24 38.99,24 40.64,25.65 40.64,26.16 42.29,27.81 43.05,27.81 44.07,28.7 v44.07,39.62 | v29.21,24.26 29.21,24.61 28.57,25.65 28.07,26.29 27.4,26.29 IC2.12 | U6.5 35.85,40.91 v35.84,40.92
  Bottom 0.254: v44.07,39.62 43.05,40.64 36.19,40.64 v35.84,40.92 | v33.53,24.77 33.02,24.26 v29.21,24.26
IO13  (via drill 0.25)
  Top 0.254: U7.6 9.24,37.62 12.32,34.42 12.32,27.43 v16.26,24.13 | IC2.8 26.3,21.21 26.42,21.21 27.94,22.73 v28.57,22.73
  Bottom 0.254: v16.26,24.13 27.43,24.13 v28.57,22.73
IO14  (via drill 0.25)
  Top 0.254: U7.5 8.98,37.12 11.81,34.16 11.81,26.8 v15.75,23.5 | IC2.7 26.23,20.57 26.67,20.57 v27.94,21.84
  Bottom 0.254: v27.94,21.84 26.54,23.62 v15.75,23.5
LINKRX  (via drill 0.25)
  Top 0.254: IC2.28 19.84,19.56 v19.05,19.56
  Bottom 0.254: U1.4 10.58,16.98 10.79,16.51 11.43,16.51 12.19,15.62 13.46,15.62 14.35,16.64 14.35,19.05 16,20.7 18.42,20.7 19.05,20.07 v19.05,19.56
LINKTR  (via drill 0.25)
  Top 0.254: v17.27,21.34 17.91,21.34 18.54,20.7 19.57,20.7 IC2.26
  Bottom 0.254: U1.3 U1.2 11.88,16.95 12.45,16.26 13.21,16.26 13.72,16.76 13.72,19.18 15.75,21.34 | 15.75,21.34 v17.27,21.34 | 15.75,21.34 15.37,21.34 15.11,21.72 14.35,21.72 13.84,22.1 13.84,22.99 13.22,23.61 R1.1
LINKTX  (via drill 0.25)
  Top 0.254: IC2.30 20.57,18.88 v20.32,17.65 | v18.31,19.1 17.4,19.18 15.49,21.08 v14.61,21.06
  Bottom 0.254: U1.1 12.53,16.93 12.7,16.76 12.95,16.76 13.21,17.02 13.21,19.68 v14.61,21.06 | v20.32,17.65 19.05,17.53 18.03,18.67 v18.31,19.1
N$1  (via drill 0.25)
  Top 0.406: J2.P$3 2.47,33.98 4.7,31.75 v4.7,27.05
  Bottom 0.254: J3.P$3 39.81,33.85 38.1,36.07 4.75,36.07 2.67,33.98 2.67,33.78 2.47,33.98 J2.P$3
  Bottom 0.406: v4.7,27.05 4.7,24.26 5.59,23.37 7.49,23.37 SJ4.1 7.65,23.37 9.02,23.37 9.26,23.61 R17.2
N$2
  Top 0.61: R21.2 LED2.C
N$3
  Top 0.254: 20.59,6.59 R12.2 20.57,6.6 20.96,6.22 25.82,6.22 C5.2
N$4  (via drill 0.6, 0.61)
  Top 0.254: U2.8 U2.7 | 26.42,9.82 L1.P$2 26.54,9.79
  Top 0.457: U2.7 24.38,11.98 24.38,11.3 26.42,9.82
  Top 0.61: D6.A 18.69,12.04 v19.43,11.3 | v26.54,11.3 26.54,9.79
  Bottom 0.61: v19.43,11.3 v26.54,11.3
N$5
  Top 0.406: U5.4 39.82,11.25 C4.2 | LED1.A 43.43,9.27 42.93,8.76 38.99,8.76 38.99,9.14 37.33,10.8 D1.C
  Top 0.61: C4.2 37.34,11.19 D1.C
N$6  (via drill 0.25)
  Top 0.254: U2.2 21.53,7.62 v22.1,7.06 | v22.48,5.49 26.84,5.5 27.05,5.71 C1.2
  Bottom 0.254: v22.1,7.06 22.11,5.91 v22.48,5.49
N$7
  Top 0.305: F1.2 34.24,9.07 35.68,7.62 JP2.VBUS
N$8
  Top 0.254: U2.12 21.04,13.13 20.96,13.21 20.7,13.21 20.57,13.08 R12.1
N$9
  Top 0.406: F1.1 34.24,14.55 35.18,15.24 36.82,15.24 D1.A
N$10
  Top 0.254: U6.2 39.4,39.91 39.78,40.11 42.55,40.13 43.56,41.15 43.56,42.09 JP5.1
N$11
  Top 0.254: U6.3 39.26,40.41 40,40.89 40.77,40.89 41.02,41.15 41.02,42.09 JP5.2
N$12
  Top 0.406: U5.1 41.73,15.76 R19.2
N$13
  Top 0.61: R19.1 LED1.C
N$14
  Top 0.254: U7.2 6.07,38.12 4.19,40 JP6.1
N$15
  Top 0.254: U7.3 5.69,37.62 3.56,39.75 2.03,39.75 1.65,40.13 JP6.2
N$16
  Bottom 0.406: U1.7 11.88,22.54 10.79,23.62 10.79,24.77 10.54,25.02 10.02,25.02 R17.1 9.41,24.91 9.02,24.51 7.59,24.51 SJ3.2
N$17
  Bottom 0.406: U1.6 11.23,21.91 11.05,22.1 9.91,22.1 9.27,21.46 9.27,20.45 8.89,20.07 R16.1 8.07,19.29 7.62,18.8 3.28,18.8 SJ2.1
N$18
  Bottom 0.406: R13.2 2.78,16.62 3.3,17.14 3.3,17.9 SJ2.2
N$19
  Bottom 0.406: SJ4.2 7.57,22.28 8,21.84 8,21.33 R20.2
N$20
  Bottom 0.406: 7.48,25.43 SJ3.1 6.84,26.07 R14.1
N$21  (via drill 0.25)
  Top 0.406: J2.P$2 3.19,31.48 3.94,30.73 v3.94,27.81
  Bottom 0.254: J3.P$2 41.62,31.37 39.12,31.37 38.48,32 38.48,33.91 37.34,35.43 4.95,35.43 3.81,34.29 3.81,33.4 3.3,32.89 2.54,32.89 2.29,32.64 2.29,31.61 J2.P$2 2.17,31.5
  Bottom 0.406: v3.94,27.81 3.94,22.73 5.54,21.13 R20.1 R16.2
N$22
  Top 0.61: R23.2 LED3.C
N$24  (via drill 0.25)
  Top 0.254: R15.1 16.52,9.16 17.4,10.03 v17.91,10.03 | v22.22,8.76 22.04,8.95 U2.3
  Top 0.61: R18.1 C6.1 R15.1
  Bottom 0.254: v17.91,10.03 19.94,10.03 20.7,9.27 21.72,9.27 v22.22,8.76
N$25
  Top 0.61: Q1.1 8.45,31.28 U4.1
N$26  (via drill 0.61)
  Top 0.61: v6.48,28.96 6.48,29.59 6.86,29.97 U4.2 8.89,29.97 9.84,29.02 U4.4 | Q1.2 10.37,32.56 v10.92,32
  Bottom 0.61: v6.48,28.96 5.84,28.96 5.33,29.46 | v10.92,32 11.18,32.26 11.18,33.25
  Bottom 1.27: J3.P$1 41.63,28.83 38.86,28.83 37.08,30.73 37.08,33.15 11.18,33.25 5.33,33.27 5.33,29.46 5.33,28.98 J2.P$1 J1.P$2
N$27
  Top 0.254: IC2.14 27.13,27.43 28.7,27.43 29.34,26.67 R29.2 R27.2
N$28
  Bottom 0.254: SJ1.2 26.16,16.13 27.46,17.42 U3.GPIO0
N$29
  Top 0.254: IC2.13 27.33,26.92 28.45,26.92 29.34,25.53 R28.2
N$30
  Top 0.254: Q3.3 35.94,31.75 35.05,30.73 35.05,28.7 34.11,28.02 31.76,28.02 R27.1
N$31
  Top 0.254: IC2.15 27.19,28.19 29.59,28.32 30.23,28.96 34.29,28.96 34.48,29.15 34.49,31 35,31.57 Q3.1
P0.3/ISP_COMMAND_USB_HIGH
  Top 0.254: IC2.9 26.73,23.55 29.21,23.5 29.41,23.29 R25.2 R26.1
PO1
  Top 0.61: R2.1 13.3,34.48 11.16,37.08 JP4.10
PO2
  Top 0.61: R3.1 15.75,35.52 JP4.9
PO3
  Top 0.61: R4.1 17.78,35.52 JP4.8
PO4
  Top 0.61: R5.1 19.81,35.52 JP4.7
PO5
  Top 0.61: R6.1 21.84,35.52 JP4.6
PO6
  Top 0.61: R7.1 JP4.5
PO7
  Top 0.61: R8.1 25.91,36.03 JP4.4
PO8
  Top 0.61: R9.1 27.94,35.78 JP4.3
PO9
  Top 0.61: R10.1 29.97,35.65 JP4.2
PO10
  Top 0.61: R11.1 32,35.39 JP4.1
PROG
  Top 0.406: U5.5 41.72,11.26 R24.1
PROGR  (via drill 0.25)
  Top 0.254: IC2.3 24.76,19.21 v24.76,18.67
  Bottom 0.254: v24.76,18.67 24.76,14.73 24.38,14.35 18.46,14.35 13.84,9.61 13.84,5.71 13.46,5.33 12.45,5.33 11.18,6.6 6.6,6.6 5.46,5.46 5.46,3.39 S3.1
PWRSTAT  (via drill 0.25)
  Top 0.254: v21.21,16.64 21.34,16.51 23.24,16.51 23.38,16.37 R30.1 | IC2.27 19.77,20.19 18.29,20.19 v17.91,19.81
  Bottom 0.254: v21.21,16.64 20.96,16.38 19.3,16.38 17.4,18.29 17.4,19.3 v17.91,19.81
USRBTN  (via drill 0.25)
  Top 0.254: R22.2 10.67,11.83 10.67,13.08 11.18,13.59 12.57,13.59 14.35,14.73 v14.35,15.62 | v15.11,22.86 14.73,22.86 13.97,22.1 13.97,19.43 v15.11,18.29 | IC2.16 23.88,25.72 23.88,25.91 23.8,25.98 v23.42,25.98
  Top 0.61: 10.36,11.6 R22.2 9.4,11.56 8.95,12 BTN.2
  Bottom 0.254: v15.11,22.86 15.11,24.89 19.25,24.89 19.79,25.6 20.57,25.6 20.83,25.27 22.48,25.27 23.11,25.98 v23.42,25.98 | v15.11,18.29 15.24,17.91 15.24,16 14.86,15.62 v14.35,15.62
USRLED  (via drill 0.25)
  Top 0.254: IC2.1 23.75,18.81 23.75,18.41 23.62,18.29 v22.86,18.29 | LED3.A 17.02,16.26 17.78,15.75 v19.68,15.75
  Bottom 0.254: v19.68,15.75 22.35,15.75 22.86,16.26 v22.86,18.29
VCC  (via drill 0.46, 0.61)
  Top 0.254: U2.11 U2.10 21.78,12.76 | 25.78,13.59 L1.P$1 | v23.5,13.59 22.08,15 R30.2
  Top 0.406: U5.3 39.82,20.38 39.24,20.96 38.04,20.96 J4.2
  Top 0.457: 21.78,12.76 v21.59,13.59 | v23.5,13.59 25.78,13.59
  Top 0.61: C3.2 28.83,7.75 | 28.83,7.75 28.83,10.54 26.92,12.44 | 26.92,12.44 L1.P$1 31.25,12.95 32.51,14.22 32.51,19.05 C12.1 35.29,20.18 35.81,20.7 37.79,20.7 J4.2 | 27.31,12.83 26.92,12.44 | v2.29,11.05 2.29,13.21 4.06,15.37 4.06,25.65 4.45,26.04 6.73,26.04 7.49,26.8 7.49,28.68 U4.3 7.84,28.99 v8.89,27.94 | v12.57,6.6 12.95,6.1 v15.49,6.1 | v30.12,7.97 30.04,7.75 28.83,7.75 | v6.73,30.99 6.73,34.04 7.49,34.8 9.36,34.8 Q1.3
  Bottom 0.457: v21.59,13.59 v23.5,13.59
  Bottom 0.61: v12.57,6.6 12.57,8 11.81,8.64 3.18,8.64 2.29,9.53 v2.29,11.05 | v15.49,6.1 17.08,7.93 v30.12,7.97 | v6.73,30.99 8.25,30.99 8.64,30.35 8.64,28.19 v8.89,27.94
VCCIO  (via drill 0.25)
  Top 0.254: U7.1 6.34,38.62 5.84,39.12 v5.84,39.62 | U6.1 39.5,39.41 39.5,39.37 v40.13,39.37 41.53,39.37 43.31,37.59 43.31,35.69 42.67,35.05 40.64,35.05 39.62,36.07 37.59,36.07 37.14,36.52 C21.2
  Top 0.61: JP1.10 10.85,41.02 9.98,41.02 9.63,40.67 C22.2
  Top 1.372: JP1.1 JP1.2 JP1.3 JP1.4 JP1.5 JP1.6 JP1.7 JP1.8 JP1.9 JP1.10
  Bottom 0.254: v40.13,39.37 39.62,39.37 35.43,39.32 | v5.84,39.62 10.21,39.62 JP1.10
  Bottom 1.27: JP1.1 35.43,39.32 41.96,39.32 43.81,37.47 43.81,2.92 43.18,2.29 23.09,2.29 22.58,1.77 S1.1 S1.4
WIFIRX  (via drill 0.25)
  Top 0.254: IC2.32 21.72,18.61 21.72,18.16 22.22,17.65 v25.91,17.65 | v34.42,17.27 37.85,17.27 v37.97,17.4
  Bottom 0.254: v25.91,17.65 27.18,18.92 31.11,18.92 32.77,17.27 v34.42,17.27 | v37.97,17.4 37.97,12.45 39,11.42 U3.URXD
WIFITX  (via drill 0.25)
  Top 0.254: IC2.31 21.21,18.81 21.21,17.91 22.1,17.02 v25.4,17.02 | v33.91,16.64 v38.73,16.64
  Bottom 0.254: v25.4,17.02 26.16,17.02 27.56,18.41 30.86,18.41 32.77,16.64 v33.91,16.64 | v38.73,16.64 39.12,16.26 39.12,14.22 39.92,13.42 U3.UTXD
XTALIN
  Top 0.254: C17.1 28.52,16.17 Q2.3 27.9,16.78 IC2.4
XTALOUT
  Top 0.254: Q2.1 30.47,18.68 30.48,19.56 30.48,19.92 C18.1 29.08,20.96 27.05,19.18 26.21,19.18 IC2.5

### Text on the board
tPlace: + | + | LNK | LNK | PWR | BOOST | USR | LiPo | PRG | CHR | v0.1
tNames: +
bNames: T2 | T3 | T1 | ALVARO FERRAN / PIGHIXXX | MUNDO READER S.L. 2015